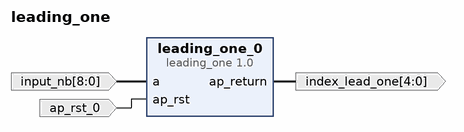
[diagram p0: block diagram of the top level]
# Vivado block design leading_one, xc7a35tcpg236-1, Vivado 2025.1
create_bd_design leading_one

create_bd_port -dir I -from 8 -to 0 -type data input_nb
create_bd_port -dir I -type rst ap_rst_0
set_property -dict {CONFIG.POLARITY ACTIVE_HIGH} [get_bd_ports ap_rst_0]
create_bd_port -dir O -from 4 -to 0 -type data index_lead_one

create_bd_cell -type ip -vlnv xilinx.com:hls:leading_one:1.0 leading_one_0

# ---- connections ----

connect_bd_net -net a_0_1 [get_bd_ports input_nb] [get_bd_pins leading_one_0/a]
connect_bd_net -net ap_rst_0_1 [get_bd_ports ap_rst_0] [get_bd_pins leading_one_0/ap_rst]
connect_bd_net [get_bd_pins leading_one_0/ap_return] [get_bd_ports index_lead_one]

validate_bd_design
save_bd_design
